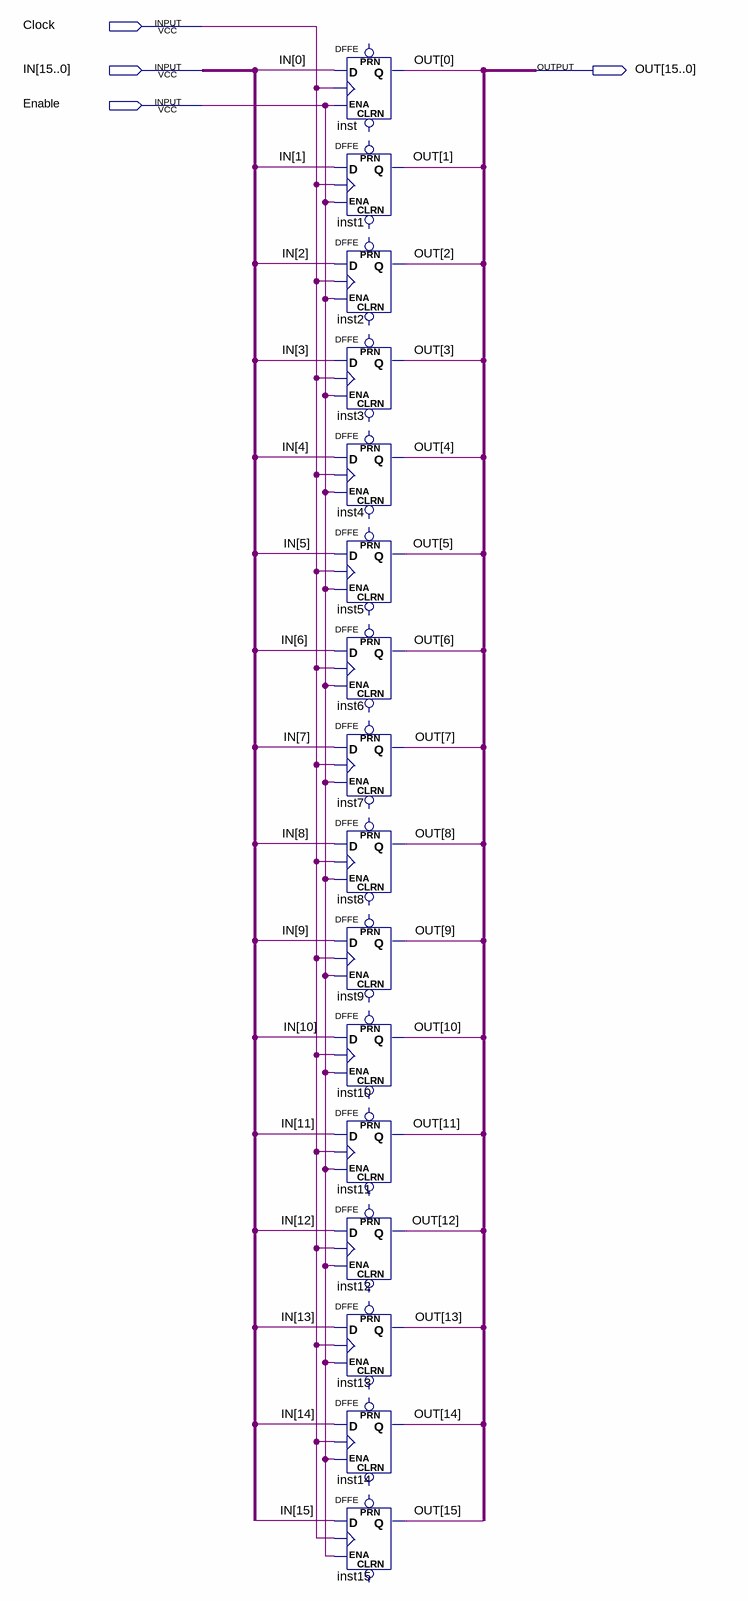
[diagram p0: schematic sheet]
// Quartus schematic registrador16.bdf as structural Verilog: 16 symbols, 4 pins
module registrador16 (
  input  Clock,
  input  [15:0] IN,
  input  Enable,
  output [15:0] OUT
);

  DFFE inst (.D(IN[0]), .CLK(Clock), .ENA(Enable), .Q(OUT[0]));  // open: PRN, CLRN
  DFFE inst1 (.D(IN[1]), .CLK(Clock), .ENA(Enable), .Q(OUT[1]));  // open: PRN, CLRN
  DFFE inst2 (.D(IN[2]), .CLK(Clock), .ENA(Enable), .Q(OUT[2]));  // open: PRN, CLRN
  DFFE inst3 (.D(IN[3]), .CLK(Clock), .ENA(Enable), .Q(OUT[3]));  // open: PRN, CLRN
  DFFE inst4 (.D(IN[4]), .CLK(Clock), .ENA(Enable), .Q(OUT[4]));  // open: PRN, CLRN
  DFFE inst5 (.D(IN[5]), .CLK(Clock), .ENA(Enable), .Q(OUT[5]));  // open: PRN, CLRN
  DFFE inst6 (.D(IN[6]), .CLK(Clock), .ENA(Enable), .Q(OUT[6]));  // open: PRN, CLRN
  DFFE inst7 (.D(IN[7]), .CLK(Clock), .ENA(Enable), .Q(OUT[7]));  // open: PRN, CLRN
  DFFE inst8 (.D(IN[8]), .CLK(Clock), .ENA(Enable), .Q(OUT[8]));  // open: PRN, CLRN
  DFFE inst9 (.D(IN[9]), .CLK(Clock), .ENA(Enable), .Q(OUT[9]));  // open: PRN, CLRN
  DFFE inst10 (.D(IN[10]), .CLK(Clock), .ENA(Enable), .Q(OUT[10]));  // open: PRN, CLRN
  DFFE inst11 (.D(IN[11]), .CLK(Clock), .ENA(Enable), .Q(OUT[11]));  // open: PRN, CLRN
  DFFE inst12 (.D(IN[12]), .CLK(Clock), .ENA(Enable), .Q(OUT[12]));  // open: PRN, CLRN
  DFFE inst13 (.D(IN[13]), .CLK(Clock), .ENA(Enable), .Q(OUT[13]));  // open: PRN, CLRN
  DFFE inst14 (.D(IN[14]), .CLK(Clock), .ENA(Enable), .Q(OUT[14]));  // open: PRN, CLRN
  DFFE inst15 (.D(IN[15]), .CLK(Clock), .ENA(Enable), .Q(OUT[15]));  // open: PRN, CLRN
endmodule
